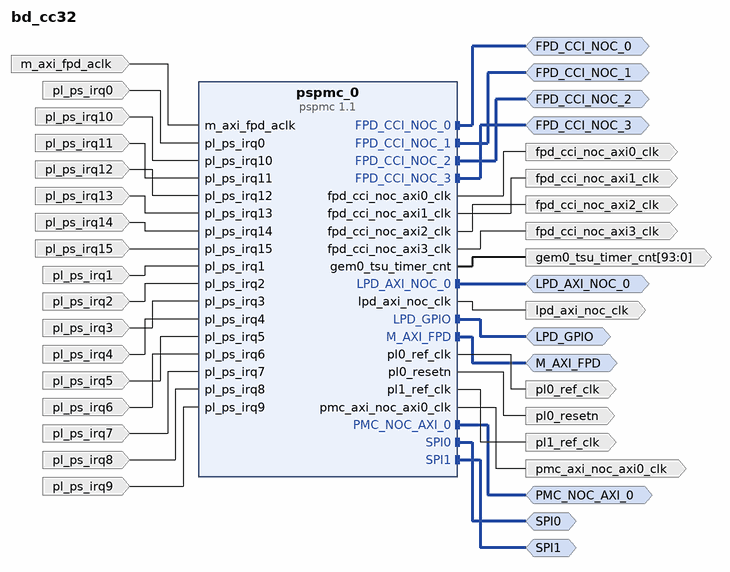
[diagram p0: block diagram of the top level]
# Vivado block design bd_cc32, xcvc1902-vsva2197-2MP-e-S, Vivado 2021.2
create_bd_design bd_cc32

create_bd_intf_port -mode Master -vlnv xilinx.com:interface:aximm_rtl:1.0 M_AXI_FPD
create_bd_intf_port -mode Master -vlnv xilinx.com:interface:aximm_rtl:1.0 FPD_CCI_NOC_0
set_property -dict {CONFIG.FREQ_HZ 824999207 CONFIG.INDEX 0} [get_bd_intf_ports FPD_CCI_NOC_0]
create_bd_intf_port -mode Master -vlnv xilinx.com:interface:aximm_rtl:1.0 FPD_CCI_NOC_1
set_property -dict {CONFIG.FREQ_HZ 824999207 CONFIG.INDEX 1} [get_bd_intf_ports FPD_CCI_NOC_1]
create_bd_intf_port -mode Master -vlnv xilinx.com:interface:aximm_rtl:1.0 FPD_CCI_NOC_2
set_property -dict {CONFIG.FREQ_HZ 824999207 CONFIG.INDEX 2} [get_bd_intf_ports FPD_CCI_NOC_2]
create_bd_intf_port -mode Master -vlnv xilinx.com:interface:aximm_rtl:1.0 FPD_CCI_NOC_3
set_property -dict {CONFIG.FREQ_HZ 824999207 CONFIG.INDEX 3} [get_bd_intf_ports FPD_CCI_NOC_3]
create_bd_intf_port -mode Master -vlnv xilinx.com:interface:aximm_rtl:1.0 LPD_AXI_NOC_0
set_property -dict {CONFIG.FREQ_HZ 591666077 CONFIG.INDEX 0} [get_bd_intf_ports LPD_AXI_NOC_0]
create_bd_intf_port -mode Master -vlnv xilinx.com:interface:aximm_rtl:1.0 PMC_NOC_AXI_0
set_property -dict {CONFIG.FREQ_HZ 400000000 CONFIG.INDEX 0 CONFIG.SLR_INDEX 0} [get_bd_intf_ports PMC_NOC_AXI_0]
create_bd_intf_port -mode Master -vlnv xilinx.com:interface:spi_rtl:1.0 SPI0
create_bd_intf_port -mode Master -vlnv xilinx.com:interface:spi_rtl:1.0 SPI1
create_bd_intf_port -mode Master -vlnv xilinx.com:interface:gpio_rtl:1.0 LPD_GPIO
create_bd_port -dir O -type clk pl0_ref_clk
set_property -dict {CONFIG.FREQ_HZ 99999901} [get_bd_ports pl0_ref_clk]
create_bd_port -dir O -type clk pl1_ref_clk
set_property -dict {CONFIG.FREQ_HZ 333333008} [get_bd_ports pl1_ref_clk]
create_bd_port -dir O -type rst pl0_resetn
create_bd_port -dir I -type clk m_axi_fpd_aclk
create_bd_port -dir O -type clk fpd_cci_noc_axi0_clk
set_property -dict {CONFIG.FREQ_HZ 824999207} [get_bd_ports fpd_cci_noc_axi0_clk]
create_bd_port -dir O -type clk fpd_cci_noc_axi1_clk
set_property -dict {CONFIG.FREQ_HZ 824999207} [get_bd_ports fpd_cci_noc_axi1_clk]
create_bd_port -dir O -type clk fpd_cci_noc_axi2_clk
set_property -dict {CONFIG.FREQ_HZ 824999207} [get_bd_ports fpd_cci_noc_axi2_clk]
create_bd_port -dir O -type clk fpd_cci_noc_axi3_clk
set_property -dict {CONFIG.FREQ_HZ 824999207} [get_bd_ports fpd_cci_noc_axi3_clk]
create_bd_port -dir O -type clk lpd_axi_noc_clk
set_property -dict {CONFIG.FREQ_HZ 591666077} [get_bd_ports lpd_axi_noc_clk]
create_bd_port -dir O -type clk pmc_axi_noc_axi0_clk
set_property -dict {CONFIG.FREQ_HZ 400000000} [get_bd_ports pmc_axi_noc_axi0_clk]
create_bd_port -dir O -from 93 -to 0 gem0_tsu_timer_cnt
create_bd_port -dir I -type intr pl_ps_irq0
create_bd_port -dir I -type intr pl_ps_irq1
create_bd_port -dir I -type intr pl_ps_irq2
create_bd_port -dir I -type intr pl_ps_irq3
create_bd_port -dir I -type intr pl_ps_irq4
create_bd_port -dir I -type intr pl_ps_irq5
create_bd_port -dir I -type intr pl_ps_irq6
create_bd_port -dir I -type intr pl_ps_irq7
create_bd_port -dir I -type intr pl_ps_irq8
create_bd_port -dir I -type intr pl_ps_irq9
create_bd_port -dir I -type intr pl_ps_irq10
create_bd_port -dir I -type intr pl_ps_irq11
create_bd_port -dir I -type intr pl_ps_irq12
create_bd_port -dir I -type intr pl_ps_irq13
create_bd_port -dir I -type intr pl_ps_irq14
create_bd_port -dir I -type intr pl_ps_irq15

create_bd_cell -type ip -vlnv xilinx.com:ip:pspmc:1.1 pspmc_0
